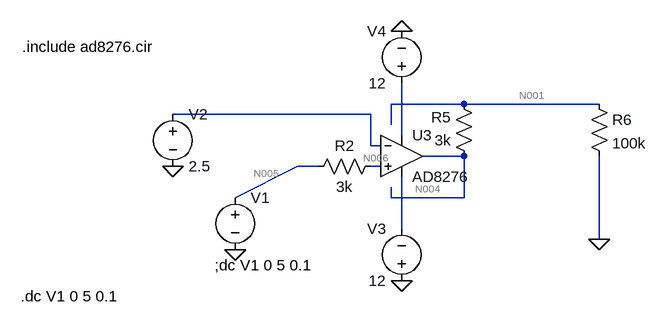
[diagram p0: schematic howland2.asc]
howland2.asc, the LTspice schematic file:
Version 4
SHEET 1 880 680
WIRE 304 80 192 80
WIRE 512 80 304 80
WIRE 160 96 -144 96
WIRE 192 112 192 80
WIRE 208 128 208 48
WIRE 160 144 160 96
WIRE 176 144 160 144
WIRE 304 160 240 160
WIRE 80 176 48 176
WIRE 176 176 160 176
WIRE -48 224 48 176
WIRE 192 224 192 208
WIRE 304 224 304 160
WIRE 304 224 192 224
WIRE 208 272 208 192
WIRE 512 288 512 160
FLAG -144 176 0
FLAG -48 304 0
FLAG 208 -32 0
FLAG 208 352 0
FLAG 512 288 0
SYMBOL res 176 160 R90
WINDOW 0 0 56 VBottom 2
WINDOW 3 32 56 VTop 2
SYMATTR InstName R2
SYMATTR Value 3k
SYMATTR SpiceLine tol=.1
SYMBOL res 320 176 R180
WINDOW 0 36 76 Left 2
WINDOW 3 36 40 Left 2
SYMATTR InstName R5
SYMATTR Value 3k
SYMATTR SpiceLine tol=.1
SYMBOL voltage -48 208 R0
WINDOW 39 0 0 Left 0
WINDOW 3 24 96 Invisible 2
SYMATTR Value PULSE(2.5 3.5 0.01 0.00001 0.00001 0.0001 0.02 3)
SYMATTR Value2 AC 1
SYMATTR InstName V1
SYMBOL voltage -144 80 R0
WINDOW 123 0 0 Left 0
WINDOW 39 0 0 Left 0
SYMATTR InstName V2
SYMATTR Value 2.5
SYMBOL res 496 64 R0
SYMATTR InstName R6
SYMATTR Value 100k
SYMATTR SpiceLine tol=.1
SYMBOL Opamps\\opamp3 208 96 R0
SYMATTR InstName U3
SYMATTR Value AD8276
SYMBOL voltage 208 368 R180
WINDOW 0 24 96 Left 2
WINDOW 3 24 16 Left 2
WINDOW 123 0 0 Left 0
WINDOW 39 0 0 Left 0
SYMATTR InstName V3
SYMATTR Value 12
SYMBOL voltage 208 64 R180
WINDOW 0 24 96 Left 2
WINDOW 3 24 16 Left 2
WINDOW 123 0 0 Left 0
WINDOW 39 0 0 Left 0
SYMATTR InstName V4
SYMATTR Value 12
TEXT -80 328 Left 2 !;dc V1 0 5 0.1
TEXT -376 -8 Left 2 !.include ad8276.cir
TEXT -378 376 Left 2 !.dc V1 0 5 0.1

The netlist it stands for:
* howland2.asc
R2 N006 N005 3k tol=.1
R5 N004 N001 3k tol=.1
V1 N005 0 PULSE(2.5 3.5 0.01 0.00001 0.00001 0.0001 0.02 3) AC 1
V2 N002 0 2.5
R6 N001 0 100k tol=.1
XU3 N006 N002 N003 N007 N004 AD8276  ; pins In+ In- V+ V- OUT
V3 0 N007 12
V4 N003 0 12
;dc V1 0 5 0.1
.include ad8276.cir
.dc V1 0 5 0.1
.backanno
.end

* Results of the author's LTspice run, read from the files saved beside the schematic
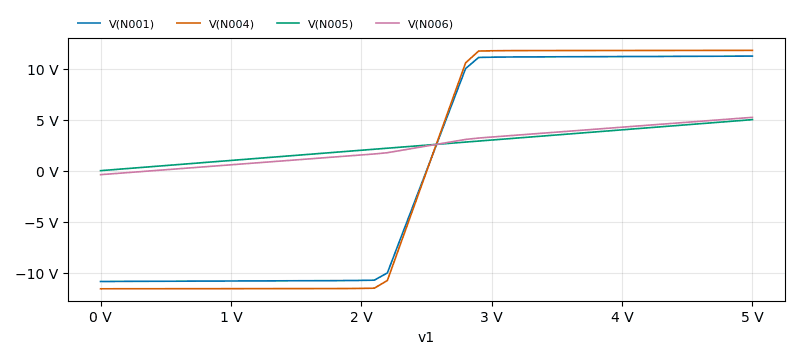
[diagram p1: DC transfer characteristic of howland2.asc, plotted from the saved traces]
* DC transfer characteristic, 1 run:
*   V(N001): -10.86 V at v1=0 V, 11.23 V at v1=5 V, min -10.86 V, max 11.23 V
*   V(N004): -11.58 V at v1=0 V, 11.79 V at v1=5 V, min -11.58 V, max 11.79 V
*   V(N005): 0 V at v1=0 V, 5 V at v1=5 V, min 0 V, max 5 V
*   V(N006): -392.6 mV at v1=0 V, 5.225 V at v1=5 V, min -392.6 mV, max 5.225 V